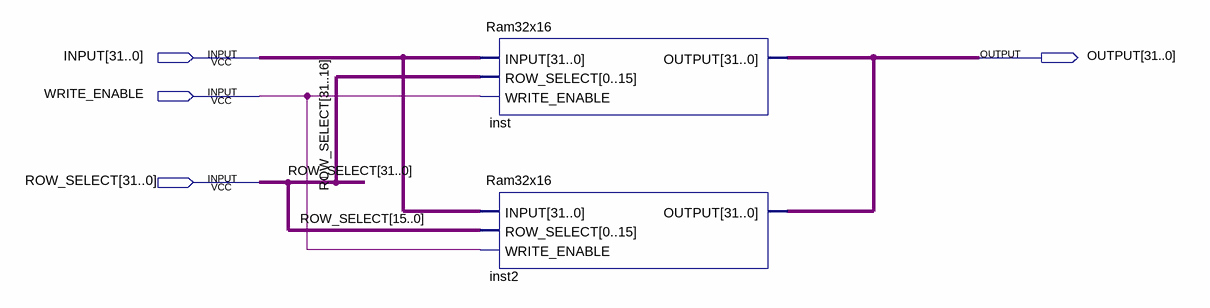
[diagram p0: schematic sheet]
// Quartus schematic Ram32x32_BLOCK.bdf as structural Verilog: 2 symbols, 4 pins
module Ram32x32_BLOCK (
  input  [31:0] INPUT,
  input  WRITE_ENABLE,
  input  [31:0] ROW_SELECT,
  output [31:0] OUTPUT
);

  Ram32x16 inst (.INPUT(INPUT), .ROW_SELECT(ROW_SELECT[31:16]), .WRITE_ENABLE(WRITE_ENABLE), .OUTPUT(OUTPUT));
  Ram32x16 inst2 (.INPUT(INPUT), .ROW_SELECT(ROW_SELECT[15:0]), .WRITE_ENABLE(WRITE_ENABLE), .OUTPUT(OUTPUT));
endmodule
